# Altium project BGT24LTR11 RF-Shield Board V3.0.PrjPCB (part 1 of 2)
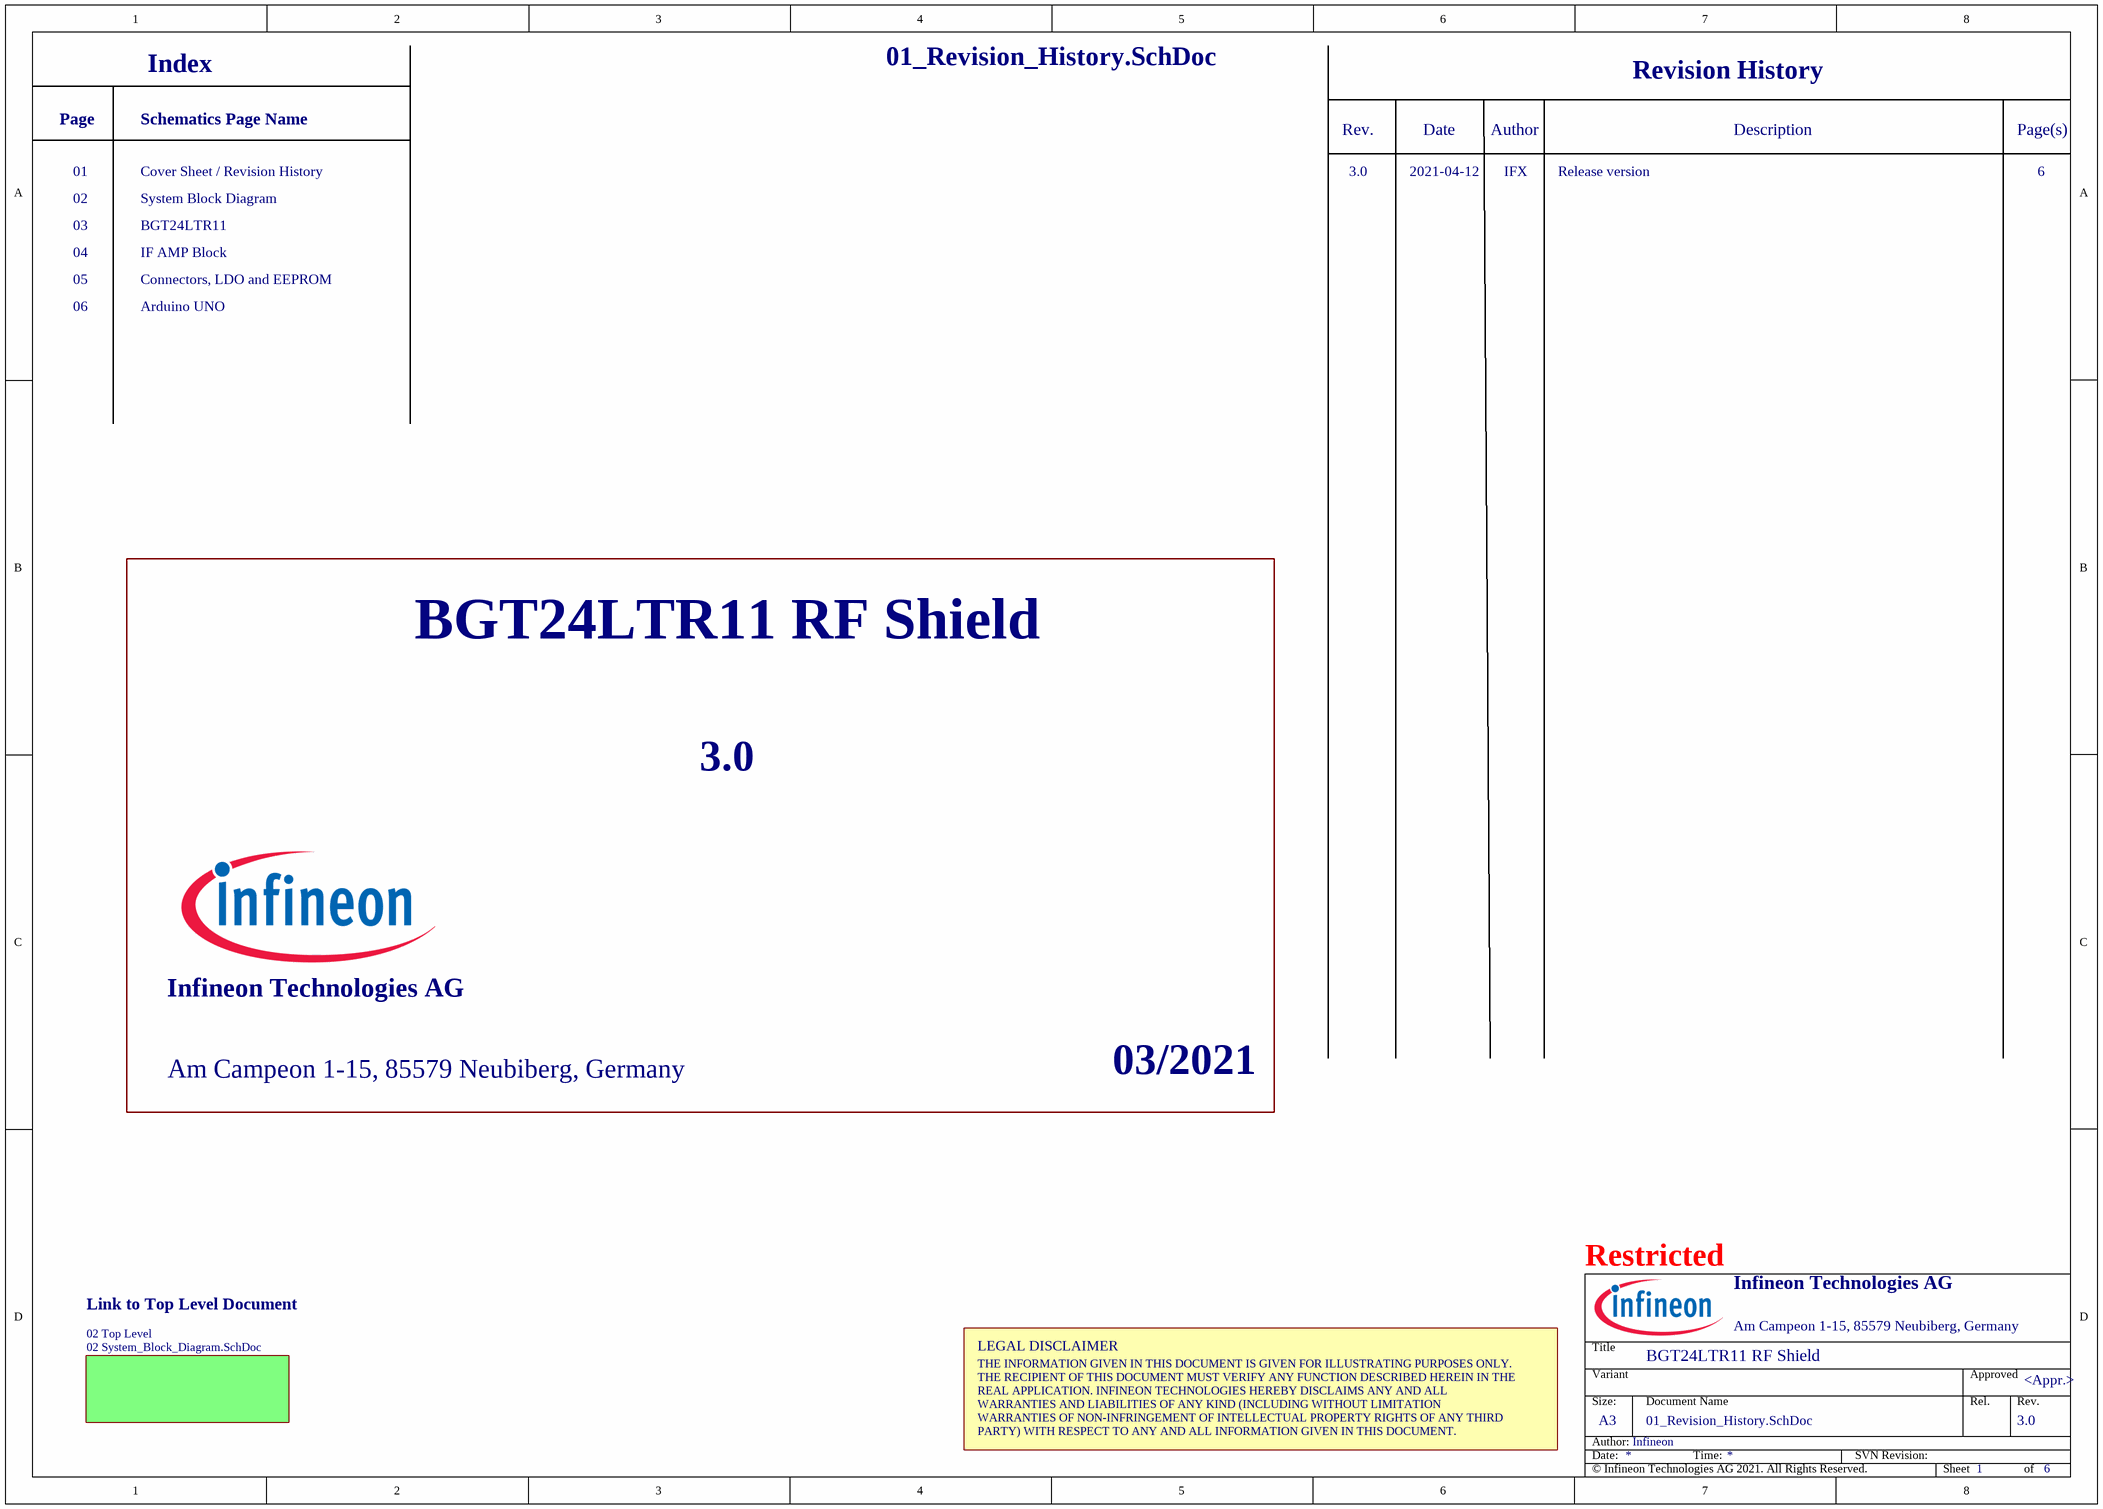
[diagram p0: 01_Revision_History.SchDoc]
PRJ_Year: 03/2021; PRJ_Title: BGT24LTR11 RF Shield; PRJ_SCH_Revision: 3.0; PRJ_SCH_Author: Infineon; PRJ_Revision: 3.0; PRJ_Organization: Infineon Technologies AG; PRJ_Copyright: © Infineon Technologies AG 2021. All Rights Reserved.; PRJ_ConfidentialStatus: Restricted; PRJ_Address2: Am Campeon 1-15, 85579 Neubiberg, Germany
6 sheets, 192 parts. Net scope: flat (ports and power ports of the same name join across sheets).
Board file: BGT24LTR11_RF-Shield_Board_V3.0.PcbDoc
Sheets:
  01_Revision_History.SchDoc
    02 Top Level = 02 System_Block_Diagram.SchDoc
      U_02 BGT24LTR11 = 03 BGT24LTR11.SchDoc
      U_03 S&H, IF AMP Block = 04 IF AMP Block.SchDoc
      U_05 Arduino UNO = 06 Arduino UNO.SchDoc
      U_04 Connector & Level Shifter Block = 05 Connectors, LDO, EEPROM.SchDoc

## Sheet 01_Revision_History.SchDoc: Tjuefire
size A3; ApprovedBy: <Appr.>; Author: <Author>; CompanyName: Infineon Technologies AG; Engineer: <Rel.>; Organization: Infineon Technologies AG; Address1: COM AC SDC SD3; Address2: Am Campeon 1-12  -  85579 Neubiberg  -  Germany; Address3: 85579 Neubiberg; Address4: Germany; Revision: <Rev.>; SheetNumber: 1; SheetTotal: 6; Release: RC00; PageSetup: Record=PageOptions|CenterHorizontal=True|CenterVertical=True|PrintScale=1.01|XCorrection=1.00|YCorrection=1.00|PrintKind=0|BorderSize=5000000|LeftOffset=0|BottomOffset=0|Orientation=2|PaperLength=1000|PaperWidth=1000|Scale=100|PaperSource=7|PrintQuality=-4|MediaType=1|DitherType=10|PaperKind=A3|PrintScaleMode=1; Doc_ConfidentialStatus: Confidential; Doc_Preliminary: Preliminary

### Sub-sheets
02 Top Level = 02 System_Block_Diagram.SchDoc: no entries

### Notes on the sheet
- Index
- Revision History
- Page
- 01
- Cover Sheet / Revision History
- Schematics Page Name
- Rev.
- 3.0
- 2021-04-12
- Date
- Author
- IFX
- Release version
- Description
- Page(s)
- 6
- 03
- 02
- System Block Diagram
- BGT24LTR11
- 04
- 05
- 06
- IF AMP Block
- Connectors, LDO and EEPROM
- Arduino UNO
- Link to Top Level Document
- LEGAL DISCLAIMER
- THE INFORMATION GIVEN IN THIS DOCUMENT IS GIVEN FOR ILLUSTRATING PURPOSES ONLY.
  THE RECIPIENT OF THIS DOCUMENT MUST VERIFY ANY FUNCTION DESCRIBED HEREIN IN THE
  REAL APPLICATION. INFINEON TECHNOLOGIES HEREBY DISCLAIMS ANY AND ALL
  WARRANTIES AND LIABILITIES OF ANY KIND (INCLUDING WITHOUT LIMITATION
  WARRANTIES OF NON-INFRINGEMENT OF INTELLECTUAL PROPERTY RIGHTS OF ANY THIRD
  PARTY) WITH RESPECT TO ANY AND ALL INFORMATION GIVEN IN THIS DOCUMENT.
- Title
- Variant
- Approved
- Date:
- Author:
- Size:
- A3
- Document Name
- Time:
- SVN Revision:
- Rel.
- Sheet
- of

## Sheet 02 System_Block_Diagram.SchDoc: <Project Name>
size A3; ApprovedBy: <Appr.>; Author: <Author>; CompanyName: Infineon Technologies AG; Engineer: <Rel.>; Organization: Infineon Technologies AG; Address1: IFAG DES S PS; Address2: Am Campeon 1-12  -  85579 Neubiberg  -  Germany; Address3: 85579 Neubiberg; Address4: Germany; Revision: <Rev.>; SheetNumber: 2; Release: RC00; PageSetup: Record=PageOptions|CenterHorizontal=True|CenterVertical=True|PrintScale=1.01|XCorrection=1.00|YCorrection=1.00|PrintKind=0|BorderSize=5000000|LeftOffset=0|BottomOffset=0|Orientation=2|PaperLength=1000|PaperWidth=1000|Scale=100|PaperSource=7|PrintQuality=-4|MediaType=1|DitherType=10|PaperKind=A3|PrintScaleMode=1; Doc_ConfidentialStatus: <Doc_ConfidentialStatus>; Doc_Preliminary: <Doc_Preliminary>
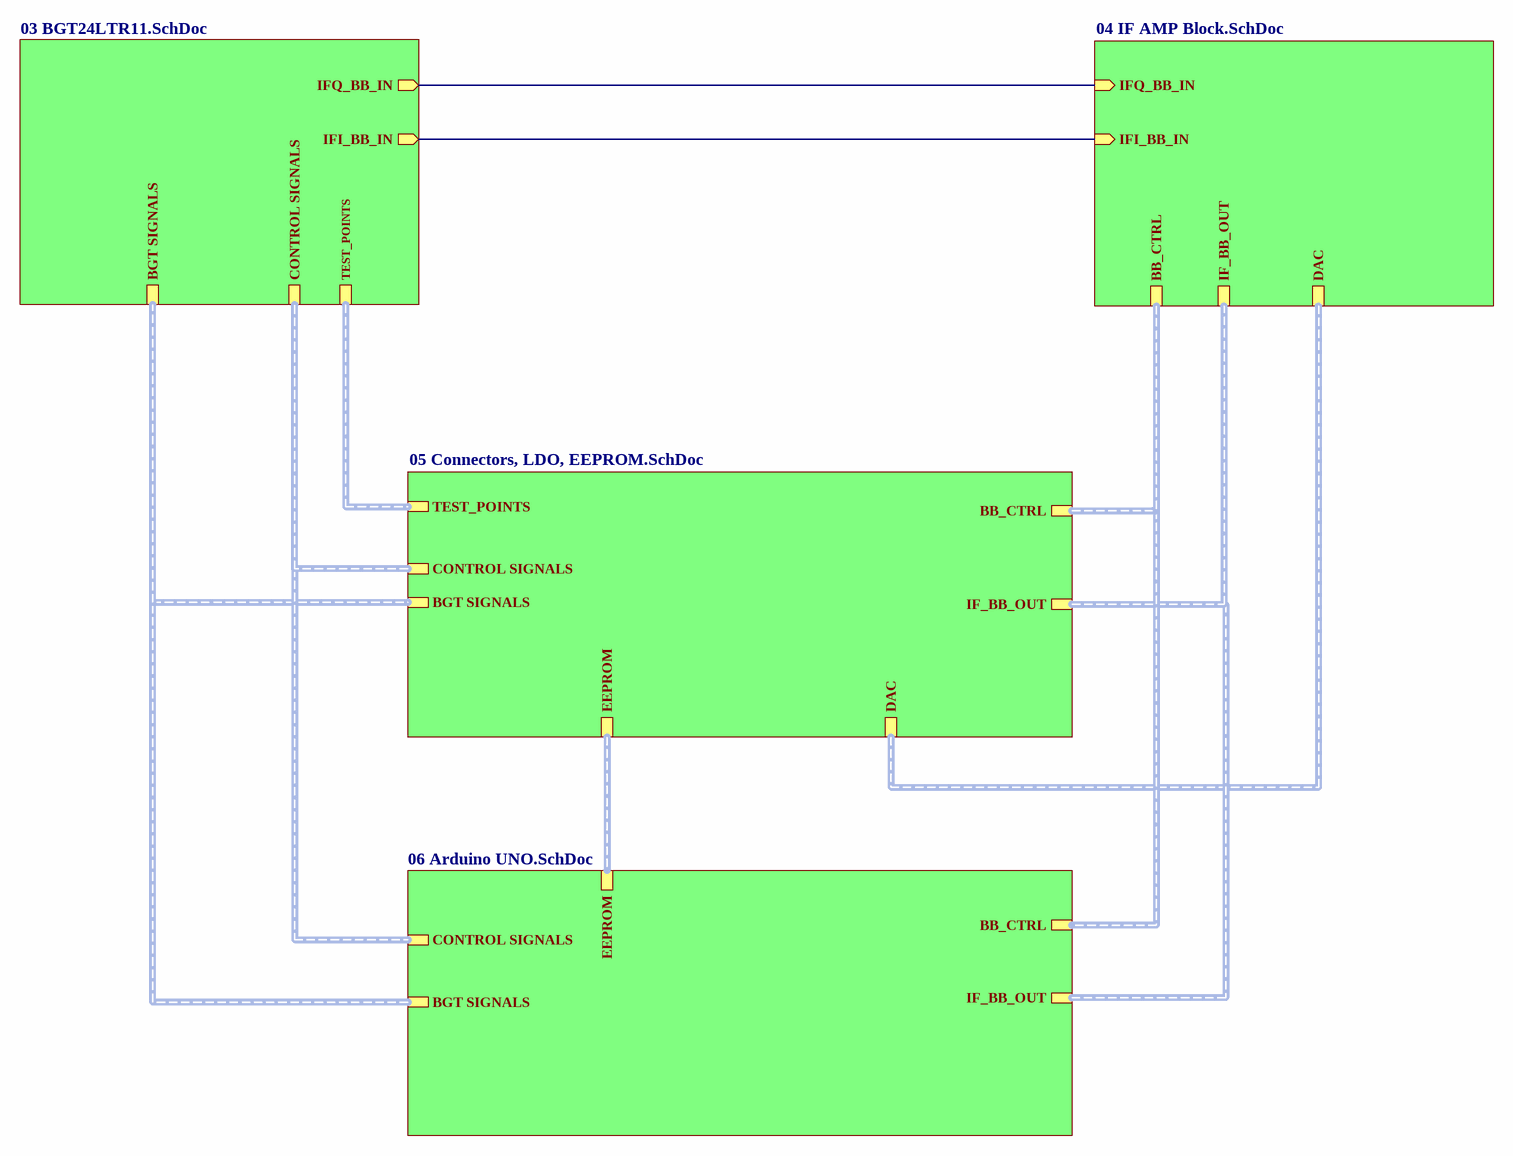
[diagram p1: 02 System_Block_Diagram.SchDoc]

### Sub-sheets
U_02 BGT24LTR11 = 03 BGT24LTR11.SchDoc: BGT SIGNALS (harness BGT_signals), CONTROL SIGNALS (harness BGT_CTRL), IFI_BB_IN (out), IFQ_BB_IN (out), TEST_POINTS (harness TEST_POINTS)
U_03 S&H, IF AMP Block = 04 IF AMP Block.SchDoc: DAC (harness DAC), IF_BB_OUT (harness IF_BB_OUT), BB_CTRL (harness BB_CTRL), IFQ_BB_IN (in), IFI_BB_IN (in)
U_04 Connector & Level Shifter Block = 05 Connectors, LDO, EEPROM.SchDoc: EEPROM (harness EEPROM), CONTROL SIGNALS (harness BGT_CTRL), DAC (harness DAC), BGT SIGNALS (harness BGT_signals), IF_BB_OUT (harness IF_BB_OUT), BB_CTRL (harness BB_CTRL), TEST_POINTS (harness TEST_POINTS)
U_05 Arduino UNO = 06 Arduino UNO.SchDoc: EEPROM (harness EEPROM), BGT SIGNALS (harness BGT_signals), IF_BB_OUT (harness IF_BB_OUT), CONTROL SIGNALS (harness BGT_CTRL), BB_CTRL (harness BB_CTRL)

### Nets
(unnamed): sheet U_02 BGT24LTR11/IFI_BB_IN, sheet U_03 S&H, IF AMP Block/IFI_BB_IN
(unnamed): sheet U_02 BGT24LTR11/IFQ_BB_IN, sheet U_03 S&H, IF AMP Block/IFQ_BB_IN

### Buses and harness runs
harness sheet U_02 BGT24LTR11/BGT SIGNALS = sheet U_04 Connector & Level Shifter Block/BGT SIGNALS = sheet U_05 Arduino UNO/BGT SIGNALS
harness sheet U_02 BGT24LTR11/CONTROL SIGNALS = sheet U_04 Connector & Level Shifter Block/CONTROL SIGNALS = sheet U_05 Arduino UNO/CONTROL SIGNALS
harness sheet U_02 BGT24LTR11/TEST_POINTS = sheet U_04 Connector & Level Shifter Block/TEST_POINTS
harness sheet U_03 S&H, IF AMP Block/BB_CTRL = sheet U_04 Connector & Level Shifter Block/BB_CTRL = sheet U_05 Arduino UNO/BB_CTRL
harness sheet U_03 S&H, IF AMP Block/DAC = sheet U_04 Connector & Level Shifter Block/DAC
harness sheet U_03 S&H, IF AMP Block/IF_BB_OUT = sheet U_04 Connector & Level Shifter Block/IF_BB_OUT = sheet U_05 Arduino UNO/IF_BB_OUT
harness sheet U_04 Connector & Level Shifter Block/EEPROM = sheet U_05 Arduino UNO/EEPROM

### Notes on the sheet
- Title
- Variant
- Approved
- Date:
- Author:
- Size:
- A3
- Document Name
- Time:
- SVN Revision:
- Rel.
- Rev.
- Sheet
- of

## Sheet 03 BGT24LTR11.SchDoc: <Project Name>
size A3; ApprovedBy: <Appr.>; Author: <Author>; CompanyName: Infineon Technologies AG; Engineer: <Rel.>; Organization: Infineon Technologies AG; Address1: IFAG DES S PS; Address2: Am Campeon 1-12  -  85579 Neubiberg  -  Germany; Address3: 85579 Neubiberg; Address4: Germany; Revision: <Rev.>; SheetNumber: 3; Release: RC00; PageSetup: Record=PageOptions|CenterHorizontal=True|CenterVertical=True|PrintScale=1.01|XCorrection=1.00|YCorrection=1.00|PrintKind=0|BorderSize=5000000|LeftOffset=0|BottomOffset=0|Orientation=2|PaperLength=1000|PaperWidth=1000|Scale=100|PaperSource=7|PrintQuality=-4|MediaType=1|DitherType=10|PaperKind=A3|PrintScaleMode=1; Doc_ConfidentialStatus: <Doc_ConfidentialStatus>; Doc_Preliminary: <Doc_Preliminary>
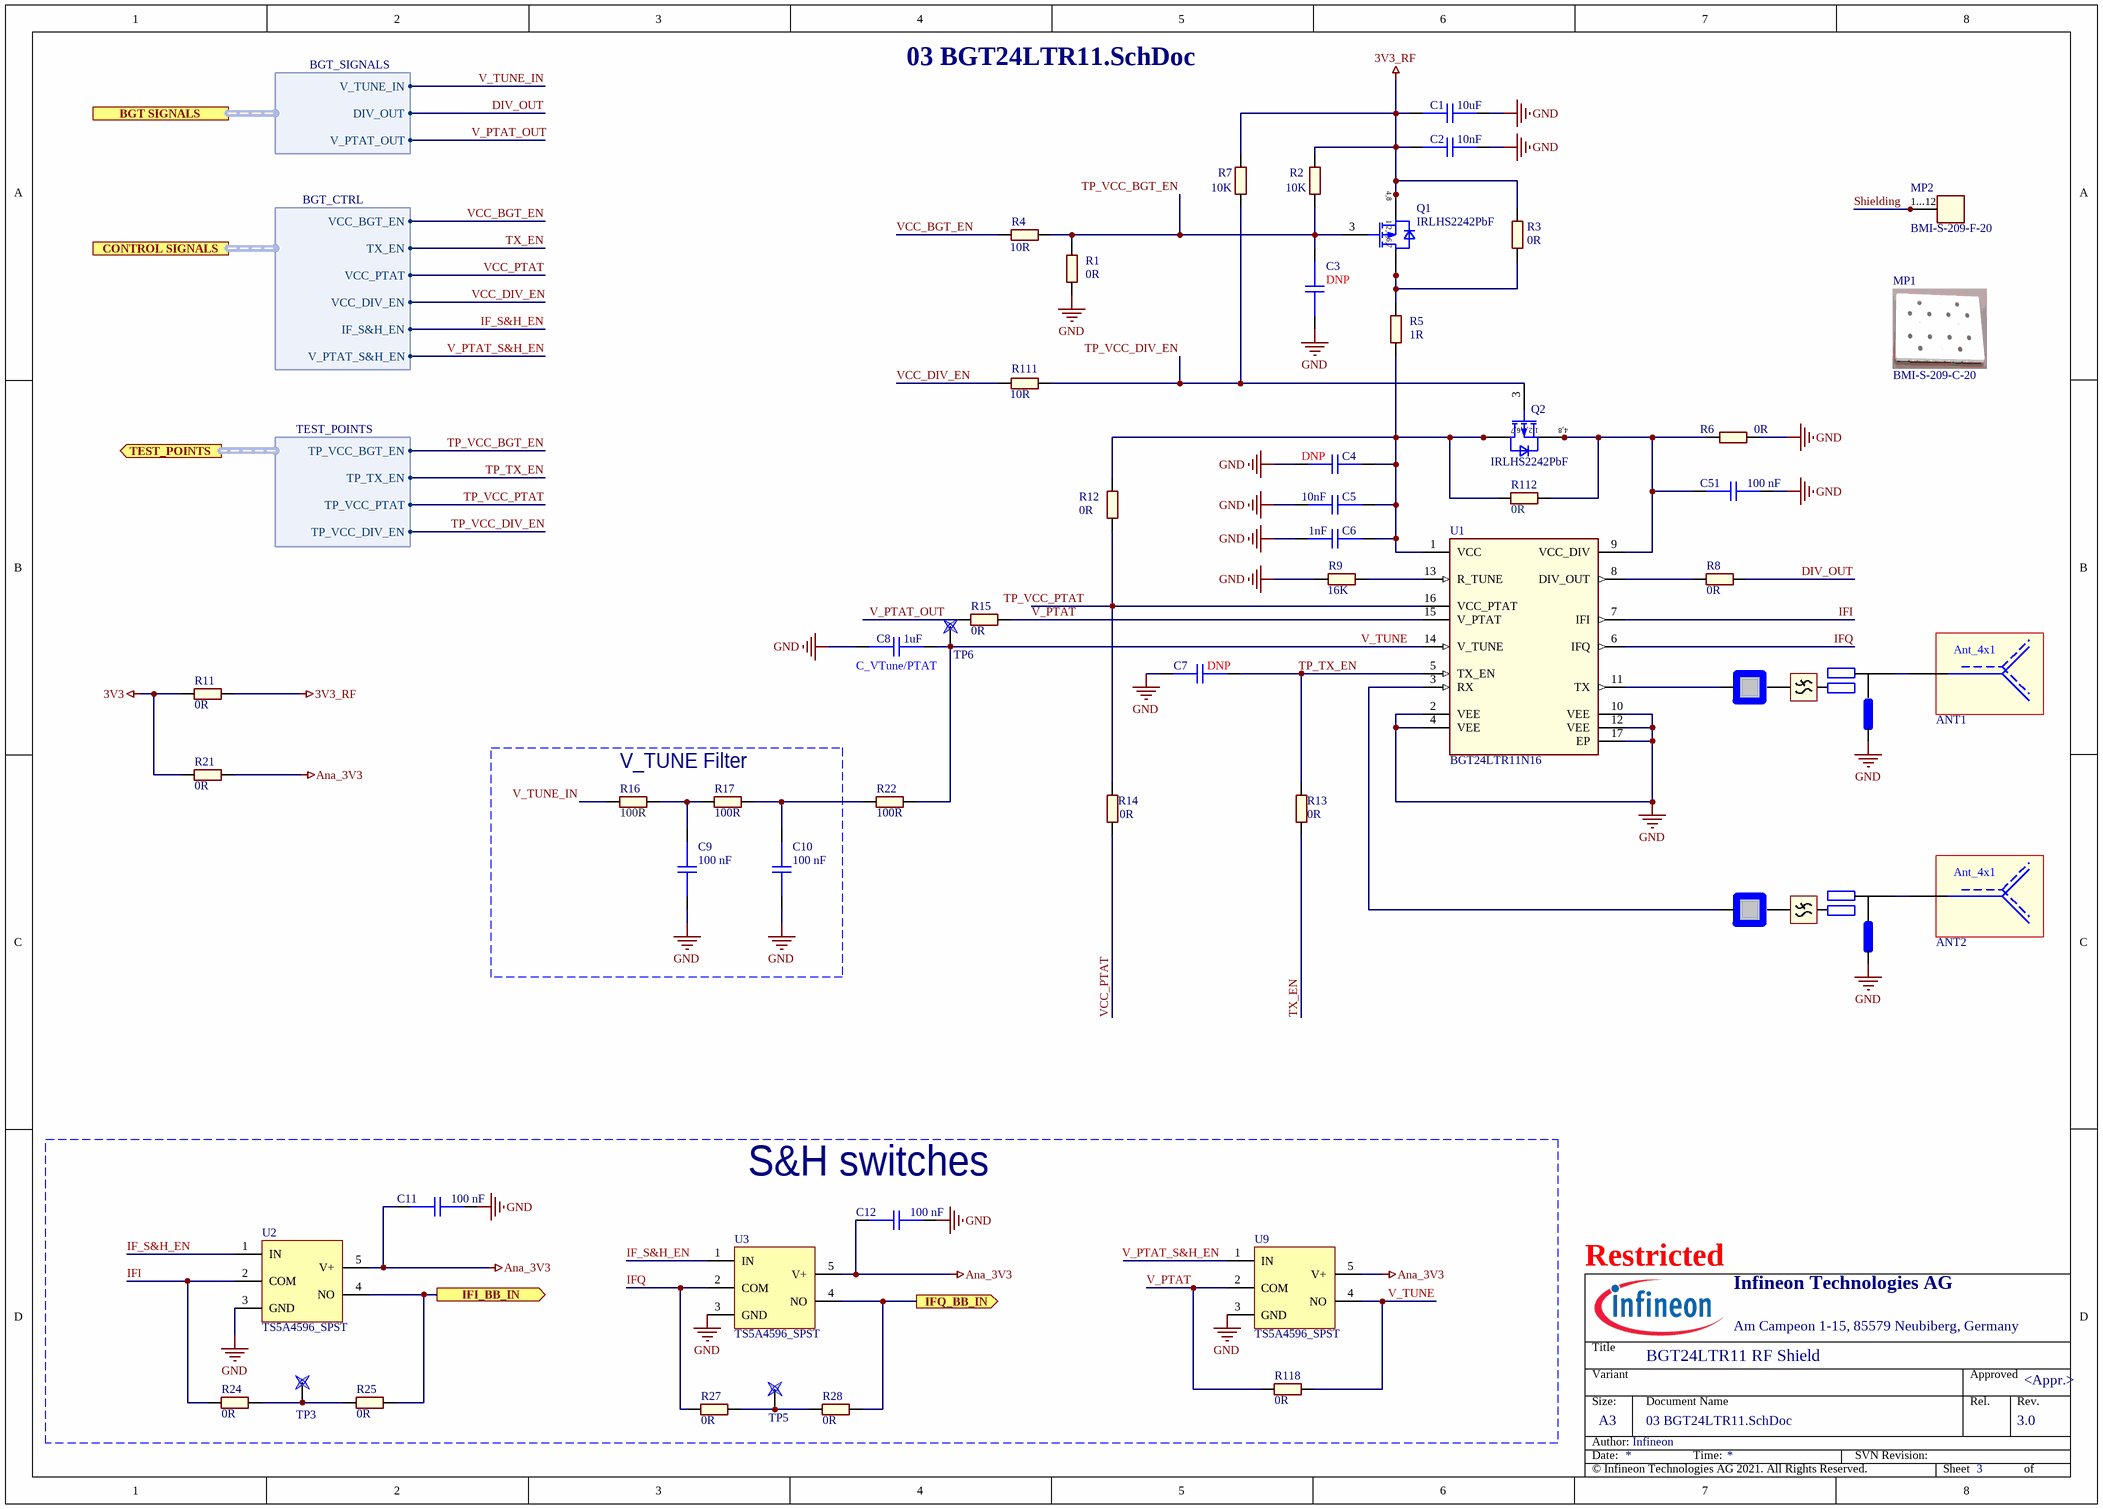
[diagram p2: 03 BGT24LTR11.SchDoc]

### Parts
ANT1  24GHZ S2G Antenna 4X1 Patch Array  [S2G_ANT]  (value not drawn)
ANT2  24GHZ S2G Antenna 4X1 Patch Array  [S2G_ANT]  (value not drawn)
C1  10uF  [CAPC1005X55N-0_2]
C2  10nF  [CAPC1005X55N-0_2]
C3  DNP  [CAPC1005X55N-0_2]
C4  DNP  [CAPC1005X55N-0_2]
C5  10nF  [CAPC1005X55N-0_2]
C6  1nF  [CAPC1005X55N-0_2]
C7  DNP  [CAPC1005X55N-0_2]
C8  1uF  [CAPC1005X55N-0_2]
C9  100 nF  [CAPC1005X55N-0_2]
C10  100 nF  [CAPC1005X55N-0_2]
C11  100 nF  [CAPC1005X55N-0_2]
C12  100 nF  [CAPC1005X55N-0_2]
C51  100 nF  [CAPC1005X55N-0_2]
M1  Maching 2nd Filter DCBlock  [MACHINING_LTR11]  (value not drawn)
M2  Maching 2nd Filter DCBlock  [OLD_MATCHING]  (value not drawn)
MP1  BMI-S-209-C-20  [SHIELD-BMI-S-209-C]
MP2  BMI-S-209-F-20  [SHIELD-SMD-BMI-S-209-F]
Q1  IRLHS2242PbF  [IRLHS2242-V]
Q2  IRLHS2242PbF  [IRLHS2242-V]
R1  0R  [RESC1005X40N_2]
R2  10K  [RESC1005X40N_2]
R3  0R  [RESC1005X40N_2]
R4  10R  [RESC1005X40N_2]
R5  1R  [RESC1005X40N_2]
R6  0R  [RESC1005X40N_2]
R7  10K  [RESC1005X40N_2]
R8  0R  [RESC1005X40N_2]
R9  16K  [RESC1005X40N_2]
R11  0R  [RESC1005X40N_2]
R12  0R  [RESC1005X40N_2]
R13  0R  [RESC1005X40N_2]
R14  0R  [RESC1005X40N_2]
R15  0R  [RESC1005X40N_2]
R16  100R  [RESC1005X40N_2]
R17  100R  [RESC1005X40N_2]
R21  0R  [RESC1005X40N_2]
R22  100R  [RESC1005X40N_2]
R24  0R  [RESC1005X40N_2]
R25  0R  [RESC1005X40N_2]
R27  0R  [RESC1005X40N_2]
R28  0R  [RESC1005X40N_2]
R111  10R  [RESC1005X40N_2]
R112  0R  [RESC1005X40N_2]
R118  0R  [RESC1005X40N_2]
TP3  Testpoint  [TP1.5MM]  (value not drawn)  (no BOM)
TP5  Testpoint  [TP1.5MM]  (value not drawn)  (no BOM)
TP6  Testpoint  [TP1.5MM]  (value not drawn)  (no BOM)
U1  BGT24LTR11N16  [PQFN50P240X240X77-17N-V]
U2  TS5A4596_SPST  [TS5A4597]
U3  TS5A4596_SPST  [TS5A4597]
U9  TS5A4596_SPST  [TS5A4597]

### Ports
BGT SIGNALS (harness BGT_SIGNALS), CONTROL SIGNALS (harness BGT_CTRL), IFI_BB_IN (out), IFQ_BB_IN (out), TEST_POINTS (out, harness TEST_POINTS)

### Harnesses
BGT_CTRL: VCC_BGT_EN, TX_EN, VCC_PTAT, VCC_DIV_EN, IF_S&H_EN, V_PTAT_S&H_EN
BGT_SIGNALS: V_TUNE_IN, DIV_OUT, V_PTAT_OUT
TEST_POINTS: TP_VCC_BGT_EN, TP_TX_EN, TP_VCC_PTAT, TP_VCC_DIV_EN

### Nets
3V3: R11.1 R21.2
3V3_RF: C1.1 C2.1 Q1.4(SOURCE1) Q1.8(SOURCE2) R2.2 R3.2 R7.2 R11.2
Ana_3V3: C11.2 C12.2 R21.1 U2.5(V+) U3.5(V+) U9.5(V+)
GND: C1.2 C2.2 C3.1 C4.1 C5.1 C6.1 C7.2 C8.2 C9.1 C10.1 C11.1 C12.1 C51.1 M1.3(GND) M2.3(GND) R1.1 R6.1 R9.1 U1.2(VEE) U1.4(VEE) U1.10(VEE) U1.12(VEE) U1.17(EP) U2.3(GND) U3.3(GND) U9.3(GND)
DIV_OUT: R8.1 ; port BGT SIGNALS.DIV_OUT  [project net CCU41_In.Slice0]
IF_S&H_EN: U2.1(IN) U3.1(IN) ; port CONTROL SIGNALS.IF_S&H_EN  [project net CCU80_Out.Slice2]
IFI: R24.2 U1.7(IFI) U2.2(COM)
IFQ: R27.2 U1.6(IFQ) U3.2(COM)
Shielding: MP2.1 MP2.2 MP2.3 MP2.4
TP_TX_EN: C7.1 R13.2 U1.5(TX_EN) ; port TEST_POINTS.TP_TX_EN
TP_VCC_BGT_EN: C3.2 Q1.3(GATE) R1.2 R2.1 R4.2 ; port TEST_POINTS.TP_VCC_BGT_EN
TP_VCC_DIV_EN: Q2.3(GATE) R7.1 R111.2 ; port TEST_POINTS.TP_VCC_DIV_EN
TP_VCC_PTAT: R12.2 R14.1 U1.16(VCC_PTAT) ; port TEST_POINTS.TP_VCC_PTAT
TX_EN: R13.1 ; port CONTROL SIGNALS.TX_EN  [project net CCU80_Out.Slice1]
V_PTAT: R15.2 R118.2 U1.15(V_PTAT) U9.2(COM)
V_PTAT_OUT: R15.1 ; port BGT SIGNALS.V_PTAT_OUT
V_PTAT_S&H_EN: U9.1(IN) ; port CONTROL SIGNALS.V_PTAT_S&H_EN  [project net CCU80_Out.Slice3]
V_TUNE: C8.1 R22.1 R118.1 TP6.1 U1.14(V_TUNE) U9.4(NO)
V_TUNE_IN: R16.2 ; port BGT SIGNALS.V_TUNE_IN  [project net V_DAC_1]
VCC_BGT_EN: R4.1 ; port CONTROL SIGNALS.VCC_BGT_EN  [project net CCU80_Out.Slice0]
VCC_DIV_EN: R111.1 ; port CONTROL SIGNALS.VCC_DIV_EN  [project net CCU42_Out.Slice1]
VCC_PTAT: R14.2 ; port CONTROL SIGNALS.VCC_PTAT  [project net CCU40_Out.Slice1]
NetANT1_1: ANT1.1 M1.2(ANT)
NetANT2_1: ANT2.1 M2.2(ANT)
NetC4_2: C4.2 C5.2 C6.2 Q2.1(DRAIN1) Q2.2(DRAIN2) Q2.5(DRAIN3) Q2.6(DRAIN4) Q2.7(DRAIN5) R5.1 R12.1 R112.2 U1.1(VCC)
NetC9_2: C9.2 R16.1 R17.2
NetC10_2: C10.2 R17.1 R22.2
NetC20_2: R25.1 U2.4(NO) ; port IFI_BB_IN
NetC28_2: R28.1 U3.4(NO) ; port IFQ_BB_IN
NetC51_2: C51.2 Q2.4(SOURCE1) Q2.8(SOURCE2) R6.2 R112.1 U1.9(VCC_DIV)
NetM1_1: M1.1(IC_IN) U1.11(TX)
NetM2_1: M2.1(IC_IN) U1.3(RX)
NetQ1_1: Q1.1(DRAIN1) Q1.2(DRAIN2) Q1.5(DRAIN3) Q1.6(DRAIN4) Q1.7(DRAIN5) R3.1 R5.2
NetR8_2: R8.2 U1.8(DIV_OUT)
NetR9_2: R9.2 U1.13(R_TUNE)
NetR24_1: R24.1 R25.2 TP3.1
NetR27_1: R27.1 R28.2 TP5.1

### Notes on the sheet
- (near C8) C_VTune/PTAT
- V_TUNE Filter
- (near C12) S&H switches
- Title
- Variant
- Approved
- Date:
- Author:
- Size:
- A3
- Document Name
- Time:
- SVN Revision:
- Rel.
- Rev.
- Sheet
- of
- (in symbol 24GHz_S2G_ANT) Ant_4x1
- (in symbol 614556) 1...12
- (in symbol IFX01401479) 4,8; 1,2,5,6,7

### Library data of the parts
ANT1 ANT2 = 24GHz_S2G_ANT
C1 = CAP01010597: General Purpose Surface Mount Ceramic Capacitor; Manufacturer: muRata; PartRelease: new; Manufacturer Component Status: Active; ComponentStatus: Released; Voltage: 10Vdc; Tolerance: 2%; TemperaturCharacteristic: C0G; AutomotiveQualified: no; ColibryArticleNumber: 308039; PartNumber: CAP01010597; Value: 10uF; PackageReference: 0402; PackageDescription: Capacitor,non-polarized,Chip;1.00mm L X 0.50mm W X 0.55mm H; ComponentHeight: 0.55mm; PartType: General Purpose Surface Mount Ceramic Capacitor; ComponentLink1Description: Vendor WebSite; ComponentLink1URL: http://www.murata.com; ComponentLink2Description: Datasheet; ComponentLink2URL: \\MUCSDN31.eu.infineon.com\PCB_Library_Datasheets\GRM1555C1H101GA01.pdf; FixedSupplier: Yes; PartProvision: No; Supplier 1: Farnell; Supplier 2: Digi-Key; Supplier 3: Mouser
C2-C8 = CAP01010597: General Purpose Surface Mount Ceramic Capacitor; Manufacturer: muRata; PartRelease: new; Manufacturer Component Status: Active; ComponentStatus: Released; Voltage: 50Vdc; Tolerance: 2%; TemperaturCharacteristic: C0G; AutomotiveQualified: no; ColibryArticleNumber: 308039; PartNumber: CAP01010597; PackageReference: 0402; PackageDescription: Capacitor,non-polarized,Chip;1.00mm L X 0.50mm W X 0.55mm H; ComponentHeight: 0.55mm; PartType: General Purpose Surface Mount Ceramic Capacitor; ComponentLink1Description: Vendor WebSite; ComponentLink1URL: http://www.murata.com; ComponentLink2Description: Datasheet; ComponentLink2URL: \\MUCSDN31.eu.infineon.com\PCB_Library_Datasheets\GRM1555C1H101GA01.pdf; FixedSupplier: Yes; PartProvision: No; Supplier 1: Farnell; Supplier 2: Digi-Key; Supplier 3: Mouser
  C2 C5: Value: 10nF
  C3 C4 C7: Value: DNP
  C6: Value: 1nF
  C8: Value: 1uF
C9-C11 C51 = CAP01010597: General Purpose Surface Mount Ceramic Capacitor; Manufacturer: muRata; PartRelease: new; Manufacturer Component Status: Active; ComponentStatus: Released; Voltage: 16Vdc; Tolerance: 2%; TemperaturCharacteristic: C0G; AutomotiveQualified: no; ColibryArticleNumber: 308039; PartNumber: CAP01010597; Value: 100 nF; Type: 100 nF; PackageReference: 0402; PackageDescription: Capacitor,non-polarized,Chip;1.00mm L X 0.50mm W X 0.55mm H; ComponentHeight: 0.55mm; PartType: General Purpose Surface Mount Ceramic Capacitor; ComponentLink1Description: Vendor WebSite; ComponentLink1URL: http://www.murata.com; ComponentLink2Description: Datasheet; ComponentLink2URL: \\MUCSDN31.eu.infineon.com\PCB_Library_Datasheets\GRM1555C1H101GA01.pdf; FixedSupplier: Yes; PartProvision: No; Supplier 1: Farnell; Supplier 2: Digi-Key; Supplier 3: Mouser
C12 = CAP01010597: General Purpose Surface Mount Ceramic Capacitor; Manufacturer: muRata; ManufacturerPartNumber: GRM1555C1H101GA01D; PartRelease: new; Manufacturer Component Status: Active; ComponentStatus: Released; Voltage: 16Vdc; Tolerance: 2%; TemperaturCharacteristic: C0G; AutomotiveQualified: no; ColibryArticleNumber: 308039; PartNumber: CAP01010597; Value: 100 nF; Type: 100 nF; PackageReference: 0402; PackageDescription: Capacitor,non-polarized,Chip;1.00mm L X 0.50mm W X 0.55mm H; ComponentHeight: 0.55mm; PartType: General Purpose Surface Mount Ceramic Capacitor; ComponentLink1Description: Vendor WebSite; ComponentLink1URL: http://www.murata.com; ComponentLink2Description: Datasheet; ComponentLink2URL: \\MUCSDN31.eu.infineon.com\PCB_Library_Datasheets\GRM1555C1H101GA01.pdf; FixedSupplier: Yes; PartProvision: No; Supplier 1: Farnell; Supplier 2: Digi-Key; Supplier Part Number 2: 490-6188-2-ND; Supplier 3: Mouser; Supplier Part Number 3: 81-GRM1555C1H101GA1D
M1 M2 = Matching_24_Duty
MP1 = 614567: Standard Board Level Shield Frame Cover 1008/1010 PRE-PLATED COLD ROLLED STEEL; Manufacturer: Laird; Alternate View: No; Symbol Type: Standard Surface Mount Shield Cover; Article Number: 614567; Version Number: V01; Legacy DeviceID: LAIRD_BMI-S-209-C-20; Combined Parameters: Steel Rectangular 29.86x- -; Style: Rectangular; PLMStatus: Active; Second Source allowed: Yes; Voltage DC (max): na; Multiple Parts: No; Part Type: Mechanical; Manufacturer Order Number: BMI-S-209-C-20; Value: BMI-S-209-C-20; Temperature Range: Military; ROHS Compliant: N; Automotive Qualified: No; ComponentLink1Description: Vendor WebSite; ComponentLink1URL: https://www.lairdtech.com; ComponentLink2Description: Datasheet; ComponentLink2URL: http://webnetprod.muc.infineon.com/PCBPortal_Prod/WorkFlows/AltiumComponent/StandardDocumentation?Versionid=614568; Supplier 1: Farnell; Supplier 2: DigiKey; Supplier Part Number 2: 903-1185-ND; Supplier 3: Mouser; Supplier Part Number 3: 739-BMIS-209-C; Package Description: Shield, 29.86 mm L X 19.00 mm W X 1.85 mm H body
MP2 = 614556: Standard Board Level Shield Frame 1008/1010 PRE-PLATED COLD ROLLED STEEL; Manufacturer: Laird; Alternate View: No; Symbol Type: Standard Surface Mount Shield Frame; Article Number: 614556; Version Number: V01; Legacy DeviceID: LAIRD_BMI-S-209-F-20; Combined Parameters: Steel Rectangular 29.36x- -; Style: Rectangular; PLMStatus: Active; Second Source allowed: Yes; Voltage DC (max): na; Multiple Parts: No; Part Type: Mechanical; Manufacturer Order Number: BMI-S-209-F-20; Value: BMI-S-209-F-20; Temperature Range: Military; ROHS Compliant: N; Automotive Qualified: No; PackageReference: SMD; ComponentLink1Description: Vendor WebSite; ComponentLink1URL: https://www.lairdtech.com; ComponentLink2Description: Datasheet; ComponentLink2URL: http://webnetprod.muc.infineon.com/PCBPortal_Prod/WorkFlows/AltiumComponent/StandardDocumentation?Versionid=614557; Supplier 1: Farnell; Supplier 2: DigiKey; Supplier Part Number 2: 903-1212-1-ND; Supplier 3: Mouser; Supplier Part Number 3: 739-BMIS-209-F; Package Description: Shield, SMD, 12 pin, 29.36 mm L X 18.50 mm W X 2.10 mm H body
Q1 Q2 = IFX01401479: HEXFET Power Mosfet, VDS -20V; Manufacturer: Infineon Technologies; PartProvision: yes; PartRelease: new; Manufacturer Component Status: Active; Alternate View: No; Symbol Type: Insulated-Gate Field-Effect Transistor (IGFET), P-Channel, Enhancement, Body Diode, Pin 1 Drain, 2 Drain, 3 Gate, 4 Source, 5 Drain, 6 Drain, 7 Drain, 8 Source, 8 Pins; ComponentName: IFX_IRLHS2242PbF; ComponentStatus: Released; ColibryArticleNumber: 431870; Multiple Parts: No; Value: IRLHS2242PbF; Supplier 1: Farnell; Supplier Part Number 1: 2114663; Supplier 2: Digi-Key; Supplier Part Number 2: IRLHS2242TRPBFTR-ND; Supplier 3: Mouser; Supplier Part Number 3: 942-IRLHS2242TRPBF; PartNumber: IFX01401479; ComponentHeight: 1mm; ManufacturerPartNumber: IRLHS2242PbF; PackageDescription: PQFN, 0.65mm Pitch, 8 Pin, 2mm L X 2mm W X 1mm H body; PackageReference: PQFN 2X2; AutomotiveQualified: no; ComponentLink1Description: Vendor WebSite; ComponentLink1URL: http://www.infineon.com; ComponentLink2Description: Datasheet; ComponentLink2URL: \\MUCSDN31.eu.infineon.com\PCB_Library_Datasheets\IRLHS2242PbF.pdf; FixedSupplier: yes
R1 R13 = RES01800000: 0R/50V/20mOhm; Manufacturer: Vishay; PartProvision: no; PartRelease: new; Manufacturer Component Status: Active; Symbol Type: Standard Resistor Symbol; Alternate View: yes; ComponentStatus: Released; Power: 1.5A; Voltage: 50V; Tolerance: 20mOhm; AutomotiveQualified: AEC-Q200; ColibryArticleNumber: 339877; PartNumber: RES01800000; PackageReference: 0402; Value: 0R; Type: 0R/50V/20mOhm; PartType: Thick Film Chip Resistor; ComponentHeight: 0.4mm; TK: -; ComponentLink1Description: Vendor WebSite; ComponentLink1URL: http://www.vishay.com/; ComponentLink2Description: Datasheet; ComponentLink2URL: \\MUCSDN31.eu.infineon.com\PCB_Library_Datasheets\dcrcwe3.pdf; FixedSupplier: no
R2 R7 = RES01800000: 10K/50V/20mOhm; Manufacturer: Vishay; PartProvision: no; PartRelease: new; Manufacturer Component Status: Active; Symbol Type: Standard Resistor Symbol; Alternate View: yes; ComponentStatus: Released; Power: 1.5A; Voltage: 50V; Tolerance: 20mOhm; AutomotiveQualified: AEC-Q200; ColibryArticleNumber: 339877; PartNumber: RES01800000; PackageReference: 0402; Value: 10K; Type: 10K/50V/20mOhm; PartType: Thick Film Chip Resistor; ComponentHeight: 0.4mm; TK: -; ComponentLink1Description: Vendor WebSite; ComponentLink1URL: http://www.vishay.com/; ComponentLink2Description: Datasheet; ComponentLink2URL: \\MUCSDN31.eu.infineon.com\PCB_Library_Datasheets\dcrcwe3.pdf; FixedSupplier: no
R3 R6 R8 R11 R12 R14 R15 R21 R24 R25 R27 R28 R112 R118 = RES01800000: 0R/50V/20mOhm; Manufacturer: Vishay; ManufacturerPartNumber: CRCW04020000Z0ED; PartProvision: no; PartRelease: new; Manufacturer Component Status: Active; Symbol Type: Standard Resistor Symbol; Alternate View: yes; ComponentStatus: Released; Power: 1.5A; Voltage: 50V; Tolerance: 20mOhm; AutomotiveQualified: AEC-Q200; ColibryArticleNumber: 339877; PartNumber: RES01800000; PackageReference: 0402; Value: 0R; Type: 0R/50V/20mOhm; PartType: Thick Film Chip Resistor; ComponentHeight: 0.4mm; TK: -; ComponentLink1Description: Vendor WebSite; ComponentLink1URL: http://www.vishay.com/; ComponentLink2Description: Datasheet; ComponentLink2URL: \\MUCSDN31.eu.infineon.com\PCB_Library_Datasheets\dcrcwe3.pdf; FixedSupplier: no
R4 R111 = RES01800000: 10R/50V/20mOhm; Manufacturer: Vishay; PartProvision: no; PartRelease: new; Manufacturer Component Status: Active; Symbol Type: Standard Resistor Symbol; Alternate View: yes; ComponentStatus: Released; Power: 1.5A; Voltage: 50V; Tolerance: 20mOhm; AutomotiveQualified: AEC-Q200; ColibryArticleNumber: 339877; PartNumber: RES01800000; PackageReference: 0402; Value: 10R; PartType: Thick Film Chip Resistor; ComponentHeight: 0.4mm; TK: -; ComponentLink1Description: Vendor WebSite; ComponentLink1URL: http://www.vishay.com/; ComponentLink2Description: Datasheet; ComponentLink2URL: \\MUCSDN31.eu.infineon.com\PCB_Library_Datasheets\dcrcwe3.pdf; FixedSupplier: no
R5 = RES01800000: 1R/50V/20mOhm; Manufacturer: Vishay; PartProvision: no; PartRelease: new; Manufacturer Component Status: Active; Symbol Type: Standard Resistor Symbol; Alternate View: yes; ComponentStatus: Released; Power: 1.5A; Voltage: 50V; Tolerance: 20mOhm; AutomotiveQualified: AEC-Q200; ColibryArticleNumber: 339877; PartNumber: RES01800000; PackageReference: 0402; Value: 1R; PartType: Thick Film Chip Resistor; ComponentHeight: 0.4mm; TK: -; ComponentLink1Description: Vendor WebSite; ComponentLink1URL: http://www.vishay.com/; ComponentLink2Description: Datasheet; ComponentLink2URL: \\MUCSDN31.eu.infineon.com\PCB_Library_Datasheets\dcrcwe3.pdf; FixedSupplier: no
R9 = RES01800000: 16K/50V/20mOhm; Manufacturer: Vishay; PartProvision: no; PartRelease: new; Manufacturer Component Status: Active; Symbol Type: Standard Resistor Symbol; Alternate View: yes; ComponentStatus: Released; Power: 1.5A; Voltage: 50V; Tolerance: 20mOhm; AutomotiveQualified: AEC-Q200; ColibryArticleNumber: 339877; PartNumber: RES01800000; PackageReference: 0402; Value: 16K; Type: 16K/50V/20mOhm; PartType: Thick Film Chip Resistor; ComponentHeight: 0.4mm; TK: -; ComponentLink1Description: Vendor WebSite; ComponentLink1URL: http://www.vishay.com/; ComponentLink2Description: Datasheet; ComponentLink2URL: \\MUCSDN31.eu.infineon.com\PCB_Library_Datasheets\dcrcwe3.pdf; FixedSupplier: no
R16 R17 R22 = RES01800000: 100R/50V/0402; Manufacturer: Vishay; PartProvision: no; PartRelease: new; Manufacturer Component Status: Active; Symbol Type: Standard Resistor Symbol; Alternate View: yes; ComponentStatus: Released; Power: 1.5A; Voltage: 50V; Tolerance: 20mOhm; AutomotiveQualified: AEC-Q200; ColibryArticleNumber: 339877; PartNumber: RES01800000; PackageReference: 0402; Value: 100R; Type: 100R/50V/0402; PartType: Thick Film Chip Resistor; ComponentHeight: 0.4mm; TK: -; ComponentLink1Description: Vendor WebSite; ComponentLink1URL: http://www.vishay.com/; ComponentLink2Description: Datasheet; ComponentLink2URL: \\MUCSDN31.eu.infineon.com\PCB_Library_Datasheets\dcrcwe3.pdf; FixedSupplier: no
TP3 TP5 TP6 = P_PRUEFPAD: FootprintBOM: Testpoint; Preis: -
U1 = IFX01401046: Silicon Germanium 24GHz Radar Transceiver MMIC; Multiple Parts: No; Manufacturer: Infineon Technologies; PartProvision: yes; PartRelease: new; Manufacturer Component Status: Active; ComponentName: IFX_BGT24LTR11N16; ComponentStatus: Released; ColibryArticleNumber: 428002; Symbol Type: Silicon Germanium 24GHz Radar Transceiver MMIC; Alternate View: No; Value: BGT24LTR11N16; Supplier 1: Farnell; Supplier 2: Digi-Key; Supplier 3: Mouser; PartNumber: IFX01401046; ComponentHeight: 0.77mm; ManufacturerPartNumber: BGT24LTR11N16; PackageDescription: PQFN,0.50mm pitch,square;16 pin,2.40mm L X 2.40mm W X 0.77mm H body (w/pullback leads,thermal tab); PackageReference: TSNP-16-9; AutomotiveQualified: no; ComponentLink1Description: Vendor WebSite; ComponentLink1URL: http://www.infineon.com; ComponentLink2Description: Datasheet; ComponentLink2URL: \\MUCSDN31.eu.infineon.com\PCB_Library_Datasheets\BGT 24LTR11N16 E6327.pdf; FixedSupplier: yes
U2 = TS5A4596DCKRSC70: Single-Channel 8ohm SPST Analog Switch TS5A4596_SPST; ComponentLink1Description: Manufacturer Link; ComponentLink1URL: http://www.ti.com/lit/ds/symlink/ts5a4597.pdf
U3 U9 = TS5A4596DCKRSC70: ComponentLink1Description: Manufacturer Link; ComponentLink1URL: http://www.ti.com/lit/ds/symlink/ts5a4597.pdf

## Sheet 04 IF AMP Block.SchDoc: <Project Name>
size A3; ApprovedBy: <Appr.>; Author: <Author>; CompanyName: Infineon Technologies AG; Engineer: <Rel.>; Organization: Infineon Technologies AG; Address1: IFAG DES S PS; Address2: Am Campeon 1-12  -  85579 Neubiberg  -  Germany; Address3: 85579 Neubiberg; Address4: Germany; Revision: <Rev.>; SheetNumber: 4; Release: RC00; PageSetup: Record=PageOptions|CenterHorizontal=True|CenterVertical=True|PrintScale=1.01|XCorrection=1.00|YCorrection=1.00|PrintKind=0|BorderSize=5000000|LeftOffset=0|BottomOffset=0|Orientation=2|PaperLength=1000|PaperWidth=1000|Scale=100|PaperSource=7|PrintQuality=-4|MediaType=1|DitherType=10|PaperKind=A3|PrintScaleMode=1; Doc_ConfidentialStatus: <Doc_ConfidentialStatus>; Doc_Preliminary: <Doc_Preliminary>
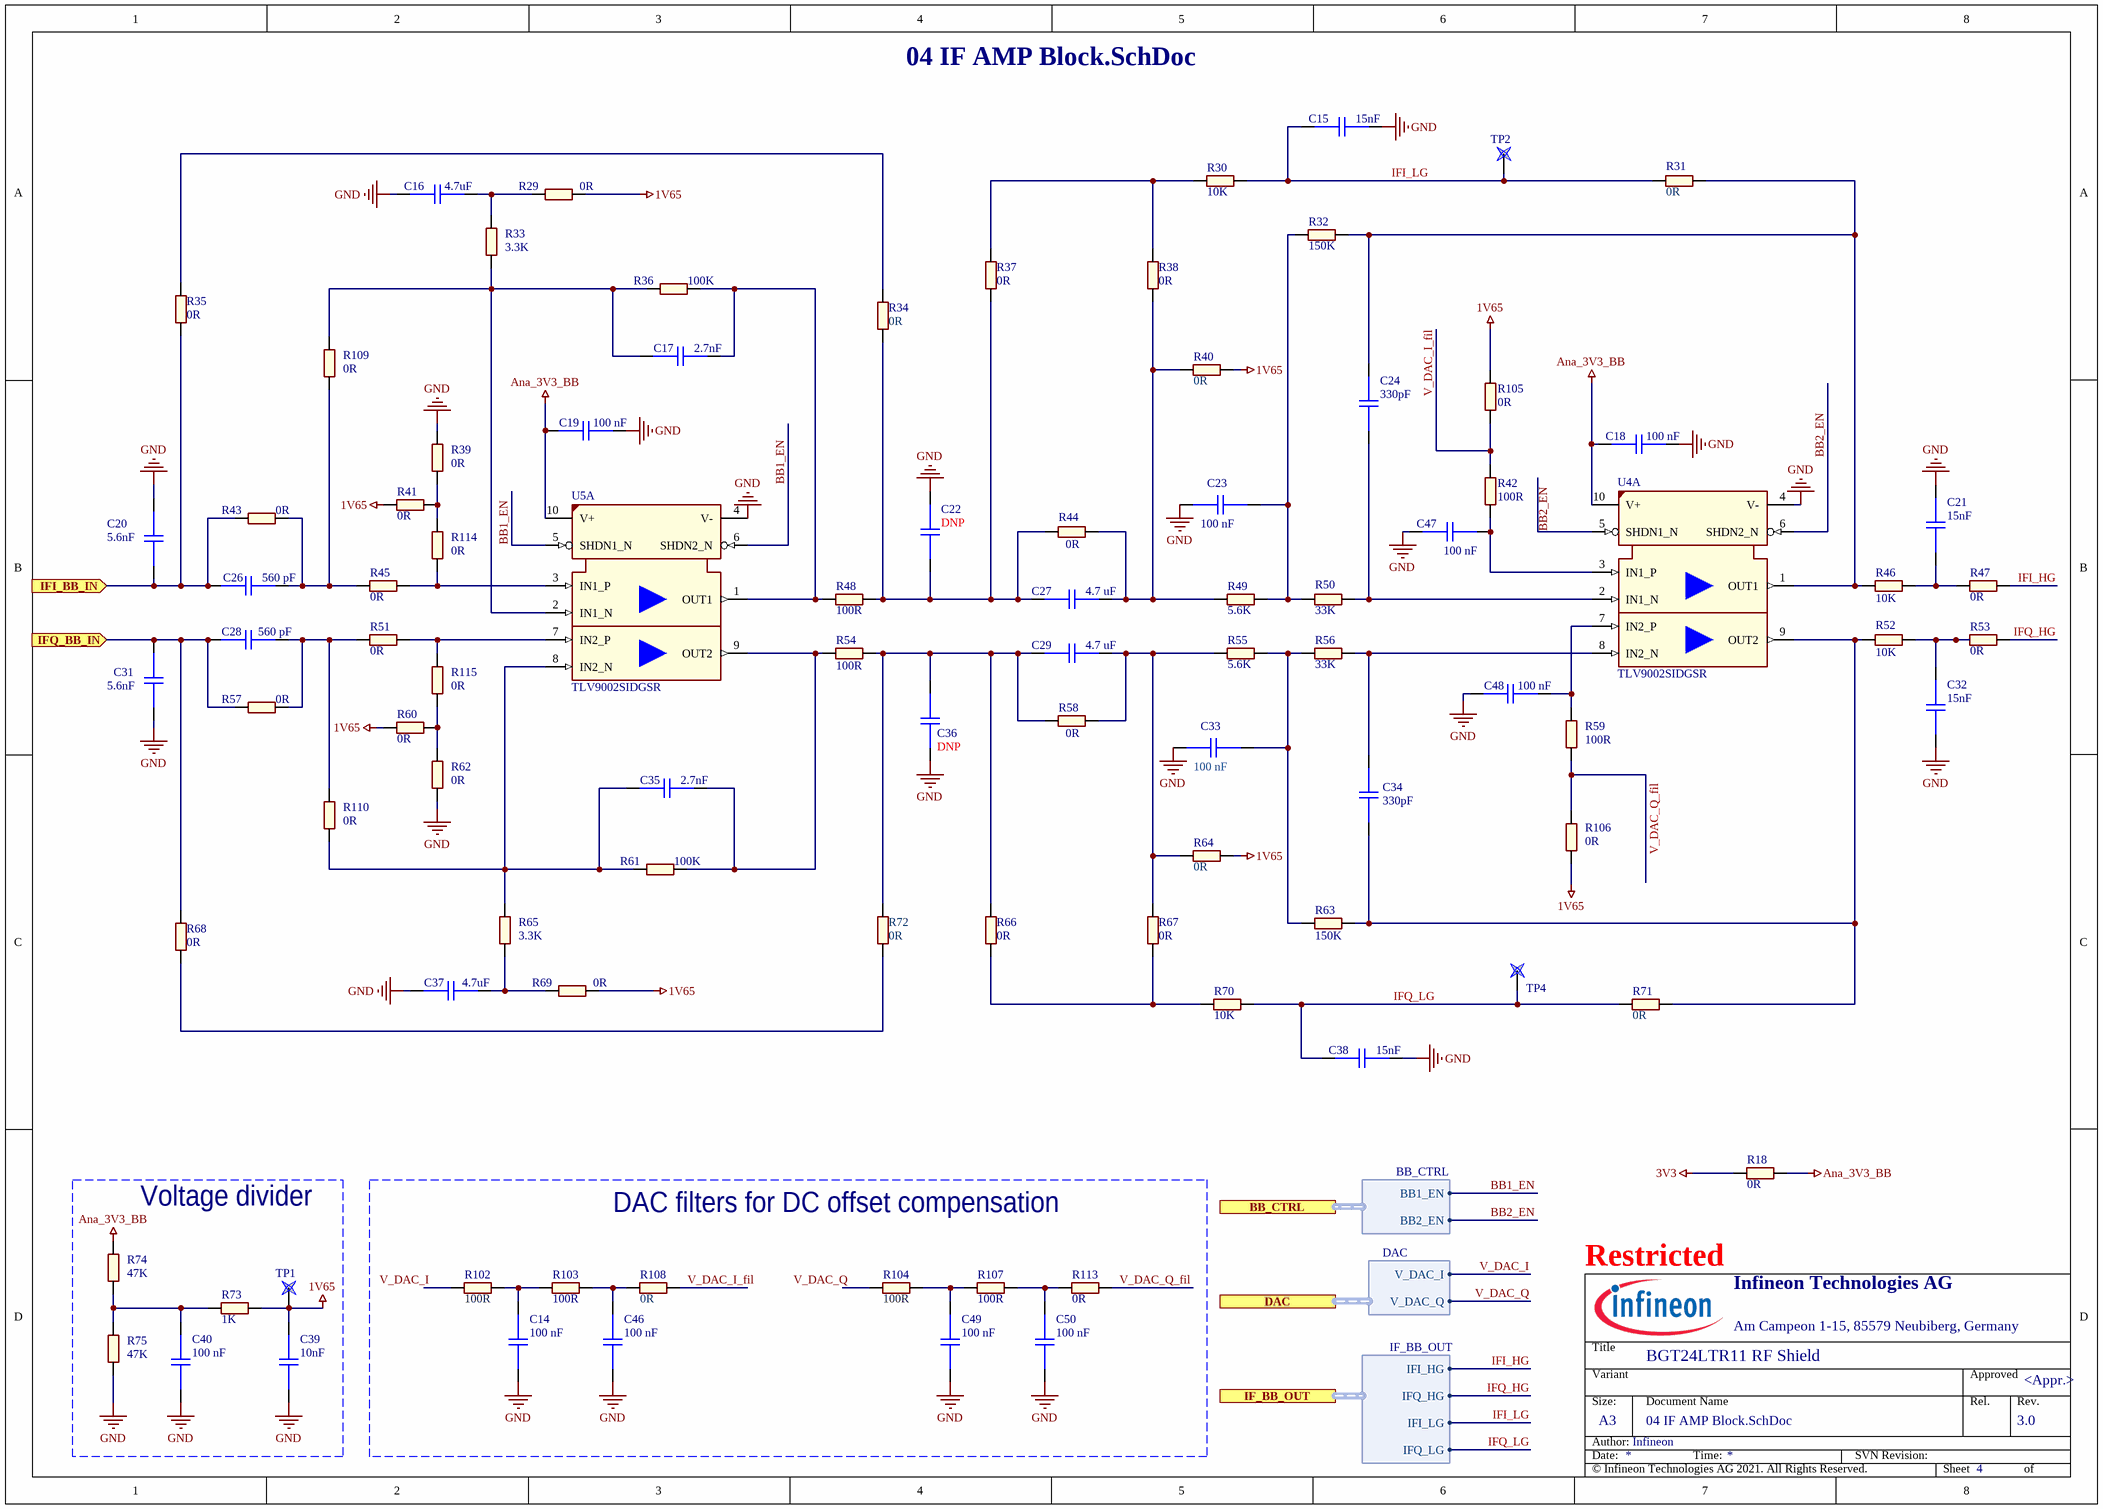
[diagram p3: 04 IF AMP Block.SchDoc]

### Parts
C14  100 nF  [CAPC1005X55N-0_2]
C15  15nF  [CAPC1005X55N-0_2]
C16  4.7uF  [CAPC1005X55N-0_2]
C17  2.7nF  [CAPC1005X55N-0_2]
C18  100 nF  [CAPC1005X55N-0_2]
C19  100 nF  [CAPC1005X55N-0_2]
C20  5.6nF  [CAPC1005X55N-0_2]
C21  15nF  [CAPC1005X55N-0_2]
C22  DNP  [CAPC1005X55N-0_2]
C23  100 nF  [CAPC1005X55N-0_2]
C24  330pF  [CAPC1005X55N-0_2]
C26  560 pF  [CAPC1005X55N-0_2]
C27  4.7 uF  [CAPC1005X55N-0_2]
C28  560 pF  [CAPC1005X55N-0_2]
C29  4.7 uF  [CAPC1005X55N-0_2]
C31  5.6nF  [CAPC1005X55N-0_2]
C32  15nF  [CAPC1005X55N-0_2]
C33  100 nF  [CAPC1005X55N-0_2]
C34  330pF  [CAPC1005X55N-0_2]
C35  2.7nF  [CAPC1005X55N-0_2]
C36  DNP  [CAPC1005X55N-0_2]
C37  4.7uF  [CAPC1005X55N-0_2]
C38  15nF  [CAPC1005X55N-0_2]
C39  10nF  [CAPC1005X55N-0_2]
C40  100 nF  [CAPC1005X55N-0_2]
C46  100 nF  [CAPC1005X55N-0_2]
C47  100 nF  [CAPC1005X55N-0_2]
C48  100 nF  [CAPC1005X55N-0_2]
C49  100 nF  [CAPC1005X55N-0_2]
C50  100 nF  [CAPC1005X55N-0_2]
R18  0R  [RESC1005X40N_2]
R29  0R  [RESC1005X40N_2]
R30  10K  [RESC1005X40N_2]
R31  0R  [RESC1005X40N_2]
R32  150K  [RESC1005X40N_2]
R33  3.3K  [RESC1005X40N_2]
R34  0R  [RESC1005X40N_2]
R35  0R  [RESC1005X40N_2]
R36  100K  [RESC1005X40N_2]
R37  0R  [RESC1005X40N_2]
R38  0R  [RESC1005X40N_2]
R39  0R  [RESC1005X40N_2]
R40  0R  [RESC1005X40N_2]
R41  0R  [RESC1005X40N_2]
R42  100R  [RESC1005X40N_2]
R43  0R  [RESC1005X40N_2]
R44  0R  [RESC1005X40N_2]
R45  0R  [RESC1005X40N_2]
R46  10K  [RESC1005X40N_2]
R47  0R  [RESC1005X40N_2]
R48  100R  [RESC1005X40N_2]
R49  5.6K  [RESC1005X40N_2]
R50  33K  [RESC1005X40N_2]
R51  0R  [RESC1005X40N_2]
R52  10K  [RESC1005X40N_2]
R53  0R  [RESC1005X40N_2]
R54  100R  [RESC1005X40N_2]
R55  5.6K  [RESC1005X40N_2]
R56  33K  [RESC1005X40N_2]
R57  0R  [RESC1005X40N_2]
R58  0R  [RESC1005X40N_2]
R59  100R  [RESC1005X40N_2]
R60  0R  [RESC1005X40N_2]
R61  100K  [RESC1005X40N_2]
R62  0R  [RESC1005X40N_2]
R63  150K  [RESC1005X40N_2]
R64  0R  [RESC1005X40N_2]
R65  3.3K  [RESC1005X40N_2]
R66  0R  [RESC1005X40N_2]
R67  0R  [RESC1005X40N_2]
R68  0R  [RESC1005X40N_2]
R69  0R  [RESC1005X40N_2]
R70  10K  [RESC1005X40N_2]
R71  0R  [RESC1005X40N_2]
R72  0R  [RESC1005X40N_2]
R73  1K  [RESC1005X40N_2]
R74  47K  [RESC1005X40N_2]
R75  47K  [RESC1005X40N_2]
R102  100R  [RESC1005X40N_2]
R103  100R  [RESC1005X40N_2]
R104  100R  [RESC1005X40N_2]
R105  0R  [RESC1005X40N_2]
R106  0R  [RESC1005X40N_2]
R107  100R  [RESC1005X40N_2]
R108  0R  [RESC1005X40N_2]
R109  0R  [RESC1005X40N_2]
R110  0R  [RESC1005X40N_2]
R113  0R  [RESC1005X40N_2]
R114  0R  [RESC1005X40N_2]
R115  0R  [RESC1005X40N_2]
TP1  Testpoint  [TP1.5MM]  (value not drawn)  (no BOM)
TP2  Testpoint  [TP1.5MM]  (value not drawn)  (no BOM)
TP4  Testpoint  [TP1.5MM]  (value not drawn)  (no BOM)
U4  TLV9002SIDGSR  [SOP50P490X110-10N-1-V]  (part A of 3)
U5  TLV9002SIDGSR  [SOP50P490X110-10N-1-V]  (part A of 3)

### Ports
BB_CTRL (harness BB_CTRL), DAC (harness DAC), IF_BB_OUT (harness IF_BB_OUT), IFI_BB_IN (in), IFQ_BB_IN (in)

### Harnesses
IF_BB_OUT: IFI_HG, IFQ_HG, IFQ_LG, IFI_LG
DAC: V_DAC_I, V_DAC_Q
BB_CTRL: BB1_EN, BB2_EN

### Nets
1V65: C39.1 R29.1 R40.1 R41.1 R60.1 R64.1 R69.1 R73.1 R105.2 R106.1 TP1.1
3V3: R18.2
Ana_3V3_BB: C18.2 C19.2 R18.1 R74.2 U4.10(V+) U5.10(V+)
GND: C14.1 C15.2 C16.1 C18.1 C19.1 C20.1 C21.1 C22.1 C23.2 C31.1 C32.2 C33.2 C36.2 C37.2 C38.1 C39.2 C40.2 C46.1 C47.2 C48.1 C49.1 C50.1 R39.2 R62.2 R75.2 U4.4(V-) U5.4(V-)
BB1_EN: U5.5(SHDN1_N) U5.6(SHDN2_N) ; port BB_CTRL.BB1_EN
BB2_EN: U4.5(SHDN1_N) U4.6(SHDN2_N) ; port BB_CTRL.BB2_EN
IFI_HG: R47.1 ; port IF_BB_OUT.IFI_HG  [project net IF.I1]
IFI_LG: C15.1 R30.2 R31.2 TP2.1 ; port IF_BB_OUT.IFI_LG  [project net IF.I2]
IFQ_HG: R53.1 ; port IF_BB_OUT.IFQ_HG  [project net IF.Q1]
IFQ_LG: C38.2 R70.2 R71.2 TP4.1 ; port IF_BB_OUT.IFQ_LG  [project net IF.Q2]
V_DAC_I: R102.2 ; port DAC.V_DAC_I  [project net V_DAC_1]
V_DAC_I_fil: R42.2 R105.1 R108.1
V_DAC_Q: R104.2 ; port DAC.V_DAC_Q  [project net V_DAC_2]
V_DAC_Q_fil: R59.2 R106.2 R113.1
NetC14_2: C14.2 R102.1 R103.2
NetC16_2: C16.2 R29.2 R33.2
NetC17_1: C17.1 R36.1 R48.2 U5.1(OUT1)
NetC17_2: C17.2 R33.1 R36.2 R109.2 U5.2(IN1_N)
NetC20_2: C20.2 C26.2 R35.2 R43.2 ; port IFI_BB_IN
NetC21_2: C21.2 R46.1 R47.2
NetC22_2: C22.2 C27.2 R34.2 R37.1 R44.2 R48.1
NetC23_1: C23.1 R32.2 R49.1 R50.2
NetC24_1: C24.1 R31.1 R32.1 R46.2 U4.1(OUT1)
NetC24_2: C24.2 R50.1 U4.2(IN1_N)
NetC26_1: C26.1 R43.1 R45.2 R109.1
NetC27_1: C27.1 R38.1 R40.2 R44.1 R49.2
NetC28_1: C28.1 R51.2 R57.1 R110.2
NetC28_2: C28.2 C31.2 R57.2 R68.1 ; port IFQ_BB_IN
NetC29_1: C29.1 R55.2 R58.1 R64.2 R67.2
NetC29_2: C29.2 C36.1 R54.1 R58.2 R66.2 R72.1
NetC32_1: C32.1 R52.1 R53.2
NetC33_1: C33.1 R55.1 R56.2 R63.2
NetC34_1: C34.1 R56.1 U4.8(IN2_N)
NetC34_2: C34.2 R52.2 R63.1 R71.1 U4.9(OUT2)
NetC35_1: C35.1 R54.2 R61.1 U5.9(OUT2)
NetC35_2: C35.2 R61.2 R65.1 R110.1 U5.8(IN2_N)
NetC37_1: C37.1 R65.2 R69.2
NetC40_1: C40.1 R73.2 R74.1 R75.1
NetC46_2: C46.2 R103.1 R108.2
NetC47_1: C47.1 R42.1 U4.3(IN1_P)
NetC48_2: C48.2 R59.1 U4.7(IN2_P)
NetC49_2: C49.2 R104.1 R107.2
NetC50_2: C50.2 R107.1 R113.2
NetR30_1: R30.1 R37.2 R38.2
NetR34_1: R34.1 R35.1
NetR39_1: R39.1 R41.2 R114.1
NetR45_1: R45.1 R114.2 U5.3(IN1_P)
NetR51_1: R51.1 R115.1 U5.7(IN2_P)
NetR60_2: R60.2 R62.1 R115.2
NetR66_1: R66.1 R67.1 R70.1
NetR68_2: R68.2 R72.2

### Notes on the sheet
- Voltage divider
- DAC filters for DC offset compensation
- Title
- Variant
- Approved
- Date:
- Author:
- Size:
- A3
- Document Name
- Time:
- SVN Revision:
- Rel.
- Rev.
- Sheet
- of

### Library data of the parts
C14 C18 C19 C23 C33 C40 C46 C49 C50 = CAP01010597: as C9 on sheet 03 BGT24LTR11; PartNumber: CAP01010597; Value: 100 nF; Type: 100 nF; PackageReference: 0402; PackageDescription: Capacitor,non-polarized,Chip;1.00mm L X 0.50mm W X 0.55mm H; ComponentHeight: 0.55mm; PartType: General Purpose Surface Mount Ceramic Capacitor; ComponentLink1Description: Vendor WebSite; ComponentLink1URL: http://www.murata.com; ComponentLink2Description: Datasheet; ComponentLink2URL: \\MUCSDN31.eu.infineon.com\PCB_Library_Datasheets\GRM1555C1H101GA01.pdf; FixedSupplier: Yes; PartProvision: No; Supplier 1: Farnell; Supplier 2: Digi-Key; Supplier 3: Mouser
C15 C21 C32 C38 = CAP01010597: General Purpose Surface Mount Ceramic Capacitor; Manufacturer: muRata; PartRelease: new; Manufacturer Component Status: Active; ComponentStatus: Released; Type: 15nF/25Vdc; Voltage: 25Vdc; Tolerance: 2%; TemperaturCharacteristic: C0G; AutomotiveQualified: no; ColibryArticleNumber: 308039; PartNumber: CAP01010597; Value: 15nF; PackageReference: 0402; PackageDescription: Capacitor,non-polarized,Chip;1.00mm L X 0.50mm W X 0.55mm H; ComponentHeight: 0.55mm; PartType: General Purpose Surface Mount Ceramic Capacitor; ComponentLink1Description: Vendor WebSite; ComponentLink1URL: http://www.murata.com; ComponentLink2Description: Datasheet; ComponentLink2URL: \\MUCSDN31.eu.infineon.com\PCB_Library_Datasheets\GRM1555C1H101GA01.pdf; FixedSupplier: Yes; PartProvision: No; Supplier 1: Farnell; Supplier 2: Digi-Key; Supplier 3: Mouser
C16 C17 C20 C26-C29 C31 C35 C37 = CAP01010597: as C2 on sheet 03 BGT24LTR11; PartNumber: CAP01010597; PackageReference: 0402; PackageDescription: Capacitor,non-polarized,Chip;1.00mm L X 0.50mm W X 0.55mm H; ComponentHeight: 0.55mm; PartType: General Purpose Surface Mount Ceramic Capacitor; ComponentLink1Description: Vendor WebSite; ComponentLink1URL: http://www.murata.com; ComponentLink2Description: Datasheet; ComponentLink2URL: \\MUCSDN31.eu.infineon.com\PCB_Library_Datasheets\GRM1555C1H101GA01.pdf; FixedSupplier: Yes; PartProvision: No; Supplier 1: Farnell; Supplier 2: Digi-Key; Supplier 3: Mouser
  C16 C37: Value: 4.7uF
  C17 C35: Value: 2.7nF
  C20 C31: Value: 5.6nF
  C26 C28: Value: 560 pF
  C27 C29: Value: 4.7 uF
C22 C36 = CAP01010597: General Purpose Surface Mount Ceramic Capacitor; Manufacturer: muRata; ManufacturerPartNumber: GRM1555C1H101GA01D; PartRelease: new; Manufacturer Component Status: Active; ComponentStatus: Released; Type: 100p/50Vdc; Voltage: 50Vdc; Tolerance: 2%; TemperaturCharacteristic: C0G; AutomotiveQualified: no; ColibryArticleNumber: 308039; PartNumber: CAP01010597; Value: DNP; PackageReference: 0402; PackageDescription: Capacitor,non-polarized,Chip;1.00mm L X 0.50mm W X 0.55mm H; ComponentHeight: 0.55mm; PartType: General Purpose Surface Mount Ceramic Capacitor; ComponentLink1Description: Vendor WebSite; ComponentLink1URL: http://www.murata.com; ComponentLink2Description: Datasheet; ComponentLink2URL: \\MUCSDN31.eu.infineon.com\PCB_Library_Datasheets\GRM1555C1H101GA01.pdf; FixedSupplier: Yes; PartProvision: No; Supplier 1: Farnell; Supplier 2: Digi-Key; Supplier Part Number 2: 490-6188-2-ND; Supplier 3: Mouser; Supplier Part Number 3: 81-GRM1555C1H101GA1D
C24 C34 = CAP01010597: General Purpose Surface Mount Ceramic Capacitor; Manufacturer: muRata; PartRelease: new; Manufacturer Component Status: Active; ComponentStatus: Released; Type: 330pF/50Vdc; Voltage: 50Vdc; Tolerance: 2%; TemperaturCharacteristic: C0G; AutomotiveQualified: no; ColibryArticleNumber: 308039; PartNumber: CAP01010597; Value: 330pF; PackageReference: 0402; PackageDescription: Capacitor,non-polarized,Chip;1.00mm L X 0.50mm W X 0.55mm H; ComponentHeight: 0.55mm; PartType: General Purpose Surface Mount Ceramic Capacitor; ComponentLink1Description: Vendor WebSite; ComponentLink1URL: http://www.murata.com; ComponentLink2Description: Datasheet; ComponentLink2URL: \\MUCSDN31.eu.infineon.com\PCB_Library_Datasheets\GRM1555C1H101GA01.pdf; FixedSupplier: Yes; PartProvision: No; Supplier 1: Farnell; Supplier 2: Digi-Key; Supplier 3: Mouser
C39 = CAP01010597: General Purpose Surface Mount Ceramic Capacitor; Manufacturer: muRata; PartRelease: new; Manufacturer Component Status: Active; ComponentStatus: Released; Type: 10nF/50Vdc; Voltage: 16Vdc; Tolerance: 2%; TemperaturCharacteristic: C0G; AutomotiveQualified: no; ColibryArticleNumber: 308039; PartNumber: CAP01010597; Value: 10nF; PackageReference: 0402; PackageDescription: Capacitor,non-polarized,Chip;1.00mm L X 0.50mm W X 0.55mm H; ComponentHeight: 0.55mm; PartType: General Purpose Surface Mount Ceramic Capacitor; ComponentLink1Description: Vendor WebSite; ComponentLink1URL: http://www.murata.com; ComponentLink2Description: Datasheet; ComponentLink2URL: \\MUCSDN31.eu.infineon.com\PCB_Library_Datasheets\GRM1555C1H101GA01.pdf; FixedSupplier: Yes; PartProvision: No; Supplier 1: Farnell; Supplier 2: Digi-Key; Supplier 3: Mouser
C47 C48 = CAP01010597: as C12 on sheet 03 BGT24LTR11; PartNumber: CAP01010597; Value: 100 nF; Type: 100 nF; PackageReference: 0402; PackageDescription: Capacitor,non-polarized,Chip;1.00mm L X 0.50mm W X 0.55mm H; ComponentHeight: 0.55mm; PartType: General Purpose Surface Mount Ceramic Capacitor; ComponentLink1Description: Vendor WebSite; ComponentLink1URL: http://www.murata.com; ComponentLink2Description: Datasheet; ComponentLink2URL: \\MUCSDN31.eu.infineon.com\PCB_Library_Datasheets\GRM1555C1H101GA01.pdf; FixedSupplier: Yes; PartProvision: No; Supplier 1: Farnell; Supplier 2: Digi-Key; Supplier Part Number 2: 490-6188-2-ND; Supplier 3: Mouser; Supplier Part Number 3: 81-GRM1555C1H101GA1D
R18 R29 R31 R34 R35 R39-R41 R43-R45 R47 R51 R53 R57 R58 R60 R62 R64 R68 R69 R71 R72 R105 R106 R109 R110 R114 R115 = RES01800000: as R3 on sheet 03 BGT24LTR11; PartNumber: RES01800000; Value: 0R; Type: 0R/50V/20mOhm; PartType: Thick Film Chip Resistor; ComponentHeight: 0.4mm; TK: -; ComponentLink1Description: Vendor WebSite; ComponentLink1URL: http://www.vishay.com/; ComponentLink2Description: Datasheet; ComponentLink2URL: \\MUCSDN31.eu.infineon.com\PCB_Library_Datasheets\dcrcwe3.pdf; FixedSupplier: no
  R18 R29 R31 R34 R35 R39-R41 R43-R45 R47 R51 R53 R57 R58 R60 R62 R64 R68 R69 R71 R72 R106 R109 R110 R114 R115: PackageReference: 0402
  R105: PackageReference: 0R
R30 R46 R52 R70 = RES01800000: as R2 on sheet 03 BGT24LTR11; PartNumber: RES01800000; PackageReference: 0402; Value: 10K; Type: 10K/50V/20mOhm; PartType: Thick Film Chip Resistor; ComponentHeight: 0.4mm; TK: -; ComponentLink1Description: Vendor WebSite; ComponentLink1URL: http://www.vishay.com/; ComponentLink2Description: Datasheet; ComponentLink2URL: \\MUCSDN31.eu.infineon.com\PCB_Library_Datasheets\dcrcwe3.pdf; FixedSupplier: no
R32 R63 = RES01800000: 150K/50V/20mOhm; Manufacturer: Vishay; PartProvision: no; PartRelease: new; Manufacturer Component Status: Active; Symbol Type: Standard Resistor Symbol; Alternate View: yes; ComponentStatus: Released; Power: 1.5A; Voltage: 50V; Tolerance: 20mOhm; AutomotiveQualified: AEC-Q200; ColibryArticleNumber: 339877; PartNumber: RES01800000; PackageReference: 0402; Value: 150K; Type: 150K/50V/20mOhm; PartType: Thick Film Chip Resistor; ComponentHeight: 0.4mm; TK: -; ComponentLink1Description: Vendor WebSite; ComponentLink1URL: http://www.vishay.com/; ComponentLink2Description: Datasheet; ComponentLink2URL: \\MUCSDN31.eu.infineon.com\PCB_Library_Datasheets\dcrcwe3.pdf; FixedSupplier: no
R33 R65 = RES01800000: 3.3K/50V/20mOhm; Manufacturer: Vishay; ManufacturerPartNumber: CRCW04020000Z0ED; PartProvision: no; PartRelease: new; Manufacturer Component Status: Active; Symbol Type: Standard Resistor Symbol; Alternate View: yes; ComponentStatus: Released; Power: 1.5A; Voltage: 50V; Tolerance: 20mOhm; AutomotiveQualified: AEC-Q200; ColibryArticleNumber: 339877; PartNumber: RES01800000; PackageReference: 0402; Value: 3.3K; Type: 3.3K/50V/20mOhm; PartType: Thick Film Chip Resistor; ComponentHeight: 0.4mm; TK: -; ComponentLink1Description: Vendor WebSite; ComponentLink1URL: http://www.vishay.com/; ComponentLink2Description: Datasheet; ComponentLink2URL: \\MUCSDN31.eu.infineon.com\PCB_Library_Datasheets\dcrcwe3.pdf; FixedSupplier: no
R36 R61 = RES01800000: 100K/50V/0402; Manufacturer: Vishay; PartProvision: no; PartRelease: new; Manufacturer Component Status: Active; Symbol Type: Standard Resistor Symbol; Alternate View: yes; ComponentStatus: Released; Power: 1.5A; Voltage: 50V; Tolerance: 20mOhm; AutomotiveQualified: AEC-Q200; ColibryArticleNumber: 339877; PartNumber: RES01800000; PackageReference: 0402; Value: 100K; Type: 100K/50V/20mOhm; PartType: Thick Film Chip Resistor; ComponentHeight: 0.4mm; TK: -; ComponentLink1Description: Vendor WebSite; ComponentLink1URL: http://www.vishay.com/; ComponentLink2Description: Datasheet; ComponentLink2URL: \\MUCSDN31.eu.infineon.com\PCB_Library_Datasheets\dcrcwe3.pdf; FixedSupplier: no
R37 R38 R66 R67 R108 R113 = RES01800000: as R1 on sheet 03 BGT24LTR11; PartNumber: RES01800000; PackageReference: 0402; Value: 0R; Type: 0R/50V/20mOhm; PartType: Thick Film Chip Resistor; ComponentHeight: 0.4mm; TK: -; ComponentLink1Description: Vendor WebSite; ComponentLink1URL: http://www.vishay.com/; ComponentLink2Description: Datasheet; ComponentLink2URL: \\MUCSDN31.eu.infineon.com\PCB_Library_Datasheets\dcrcwe3.pdf; FixedSupplier: no
R42 R48 R54 R59 R102-R104 R107 = RES01800000: as R16 on sheet 03 BGT24LTR11; PartNumber: RES01800000; PackageReference: 0402; Value: 100R; Type: 100R/50V/0402; PartType: Thick Film Chip Resistor; ComponentHeight: 0.4mm; TK: -; ComponentLink1Description: Vendor WebSite; ComponentLink1URL: http://www.vishay.com/; ComponentLink2Description: Datasheet; ComponentLink2URL: \\MUCSDN31.eu.infineon.com\PCB_Library_Datasheets\dcrcwe3.pdf; FixedSupplier: no
R49 R55 = RES01800000: 5.6K/50V/20mOhm; Manufacturer: Vishay; ManufacturerPartNumber: CRCW04020000Z0ED; PartProvision: no; PartRelease: new; Manufacturer Component Status: Active; Symbol Type: Standard Resistor Symbol; Alternate View: yes; ComponentStatus: Released; Power: 1.5A; Voltage: 50V; Tolerance: 20mOhm; AutomotiveQualified: AEC-Q200; ColibryArticleNumber: 339877; PartNumber: RES01800000; PackageReference: 0402; Value: 5.6K; Type: 5.6K/50V/20mOhm; PartType: Thick Film Chip Resistor; ComponentHeight: 0.4mm; TK: -; ComponentLink1Description: Vendor WebSite; ComponentLink1URL: http://www.vishay.com/; ComponentLink2Description: Datasheet; ComponentLink2URL: \\MUCSDN31.eu.infineon.com\PCB_Library_Datasheets\dcrcwe3.pdf; FixedSupplier: no
R50 R56 = RES01800000: 5.6K/50V/20mOhm; Manufacturer: Vishay; PartProvision: no; PartRelease: new; Manufacturer Component Status: Active; Symbol Type: Standard Resistor Symbol; Alternate View: yes; ComponentStatus: Released; Power: 1.5A; Voltage: 50V; Tolerance: 20mOhm; AutomotiveQualified: AEC-Q200; ColibryArticleNumber: 339877; PartNumber: RES01800000; PackageReference: 0402; Value: 33K; PartType: Thick Film Chip Resistor; ComponentHeight: 0.4mm; TK: -; ComponentLink1Description: Vendor WebSite; ComponentLink1URL: http://www.vishay.com/; ComponentLink2Description: Datasheet; ComponentLink2URL: \\MUCSDN31.eu.infineon.com\PCB_Library_Datasheets\dcrcwe3.pdf; FixedSupplier: no
R73 = RES01800000: 1K/50V/20mOhm; Manufacturer: Vishay; PartProvision: no; PartRelease: new; Manufacturer Component Status: Active; Symbol Type: Standard Resistor Symbol; Alternate View: yes; ComponentStatus: Released; Power: 1.5A; Voltage: 50V; Tolerance: 20mOhm; AutomotiveQualified: AEC-Q200; ColibryArticleNumber: 339877; PartNumber: RES01800000; PackageReference: 0402; Value: 1K; Type: 1K/50V/20mOhm; PartType: Thick Film Chip Resistor; ComponentHeight: 0.4mm; TK: -; ComponentLink1Description: Vendor WebSite; ComponentLink1URL: http://www.vishay.com/; ComponentLink2Description: Datasheet; ComponentLink2URL: \\MUCSDN31.eu.infineon.com\PCB_Library_Datasheets\dcrcwe3.pdf; FixedSupplier: no
R74 R75 = RES01800000: 47K/50V/20mOhm; Manufacturer: Vishay; PartProvision: no; PartRelease: new; Manufacturer Component Status: Active; Symbol Type: Standard Resistor Symbol; Alternate View: yes; ComponentStatus: Released; Power: 1.5A; Voltage: 50V; Tolerance: 20mOhm; AutomotiveQualified: AEC-Q200; ColibryArticleNumber: 339877; PartNumber: RES01800000; PackageReference: 0402; Value: 47K; Type: 47K/50V/20mOhm; PartType: Thick Film Chip Resistor; ComponentHeight: 0.4mm; TK: -; ComponentLink1Description: Vendor WebSite; ComponentLink1URL: http://www.vishay.com/; ComponentLink2Description: Datasheet; ComponentLink2URL: \\MUCSDN31.eu.infineon.com\PCB_Library_Datasheets\dcrcwe3.pdf; FixedSupplier: no
TP1 TP2 TP4 = P_PRUEFPAD: FootprintBOM: Testpoint; Preis: -
U4 U5 = 600799: Op Amp Dual Low Power Amplifier R-R I/O Â±2.75V/5.5V; Manufacturer: Texas Instruments; Alternate View: Yes; Symbol Type: Low-Power, RRIO, 1-MHz Operational Amplifier for Cost-Sensitive Systems; Article Number: 600799; Version Number: V01; Legacy DeviceID: TI_TLV9002SIDGSR; Combined Parameters: Res.:-;Fmax:-; QuickPick: Amplifier / VSSOP-10 (DGS); Automotive Qualified: No; PLMStatus: Active; Voltage DC (max): na; Multiple Parts: Yes; Part Type: Analog Parts; Manufacturer Order Number: TLV9002SIDGSR; Value: TLV9002SIDGSR; Type: Amplifier; Application: Power Electronics; Temperature min: -40; Temperature max: 125; Temperature Range: Automotive; ROHS Compliant: Y; PackageReference: VSSOP-10 (DGS); ComponentLink1Description: Vendor WebSite; ComponentLink1URL: http://www.ti.com; ComponentLink2Description: Datasheet; ComponentLink2URL: http://webnetprod.muc.infineon.com/PCBPortal_Prod/WorkFlows/AltiumComponent/StandardDocumentation?Versionid=600800; Supplier 1: Farnell; Supplier 2: DigiKey; Supplier Part Number 2: 296-53198-1-ND; Supplier 3: Mouser; Supplier Part Number 3: 595-TLV9002SIDGSR; Second Source allowed: Yes; Package Description: SOP,0.50mm pitch;10 pin,3.00mm W X 3.00mm L X 1.10mm H body